# EAGLE design oresat0-plusz-end-card (EAGLE 9.6.2)

## Sheet 1 of 4: CONNECTORS
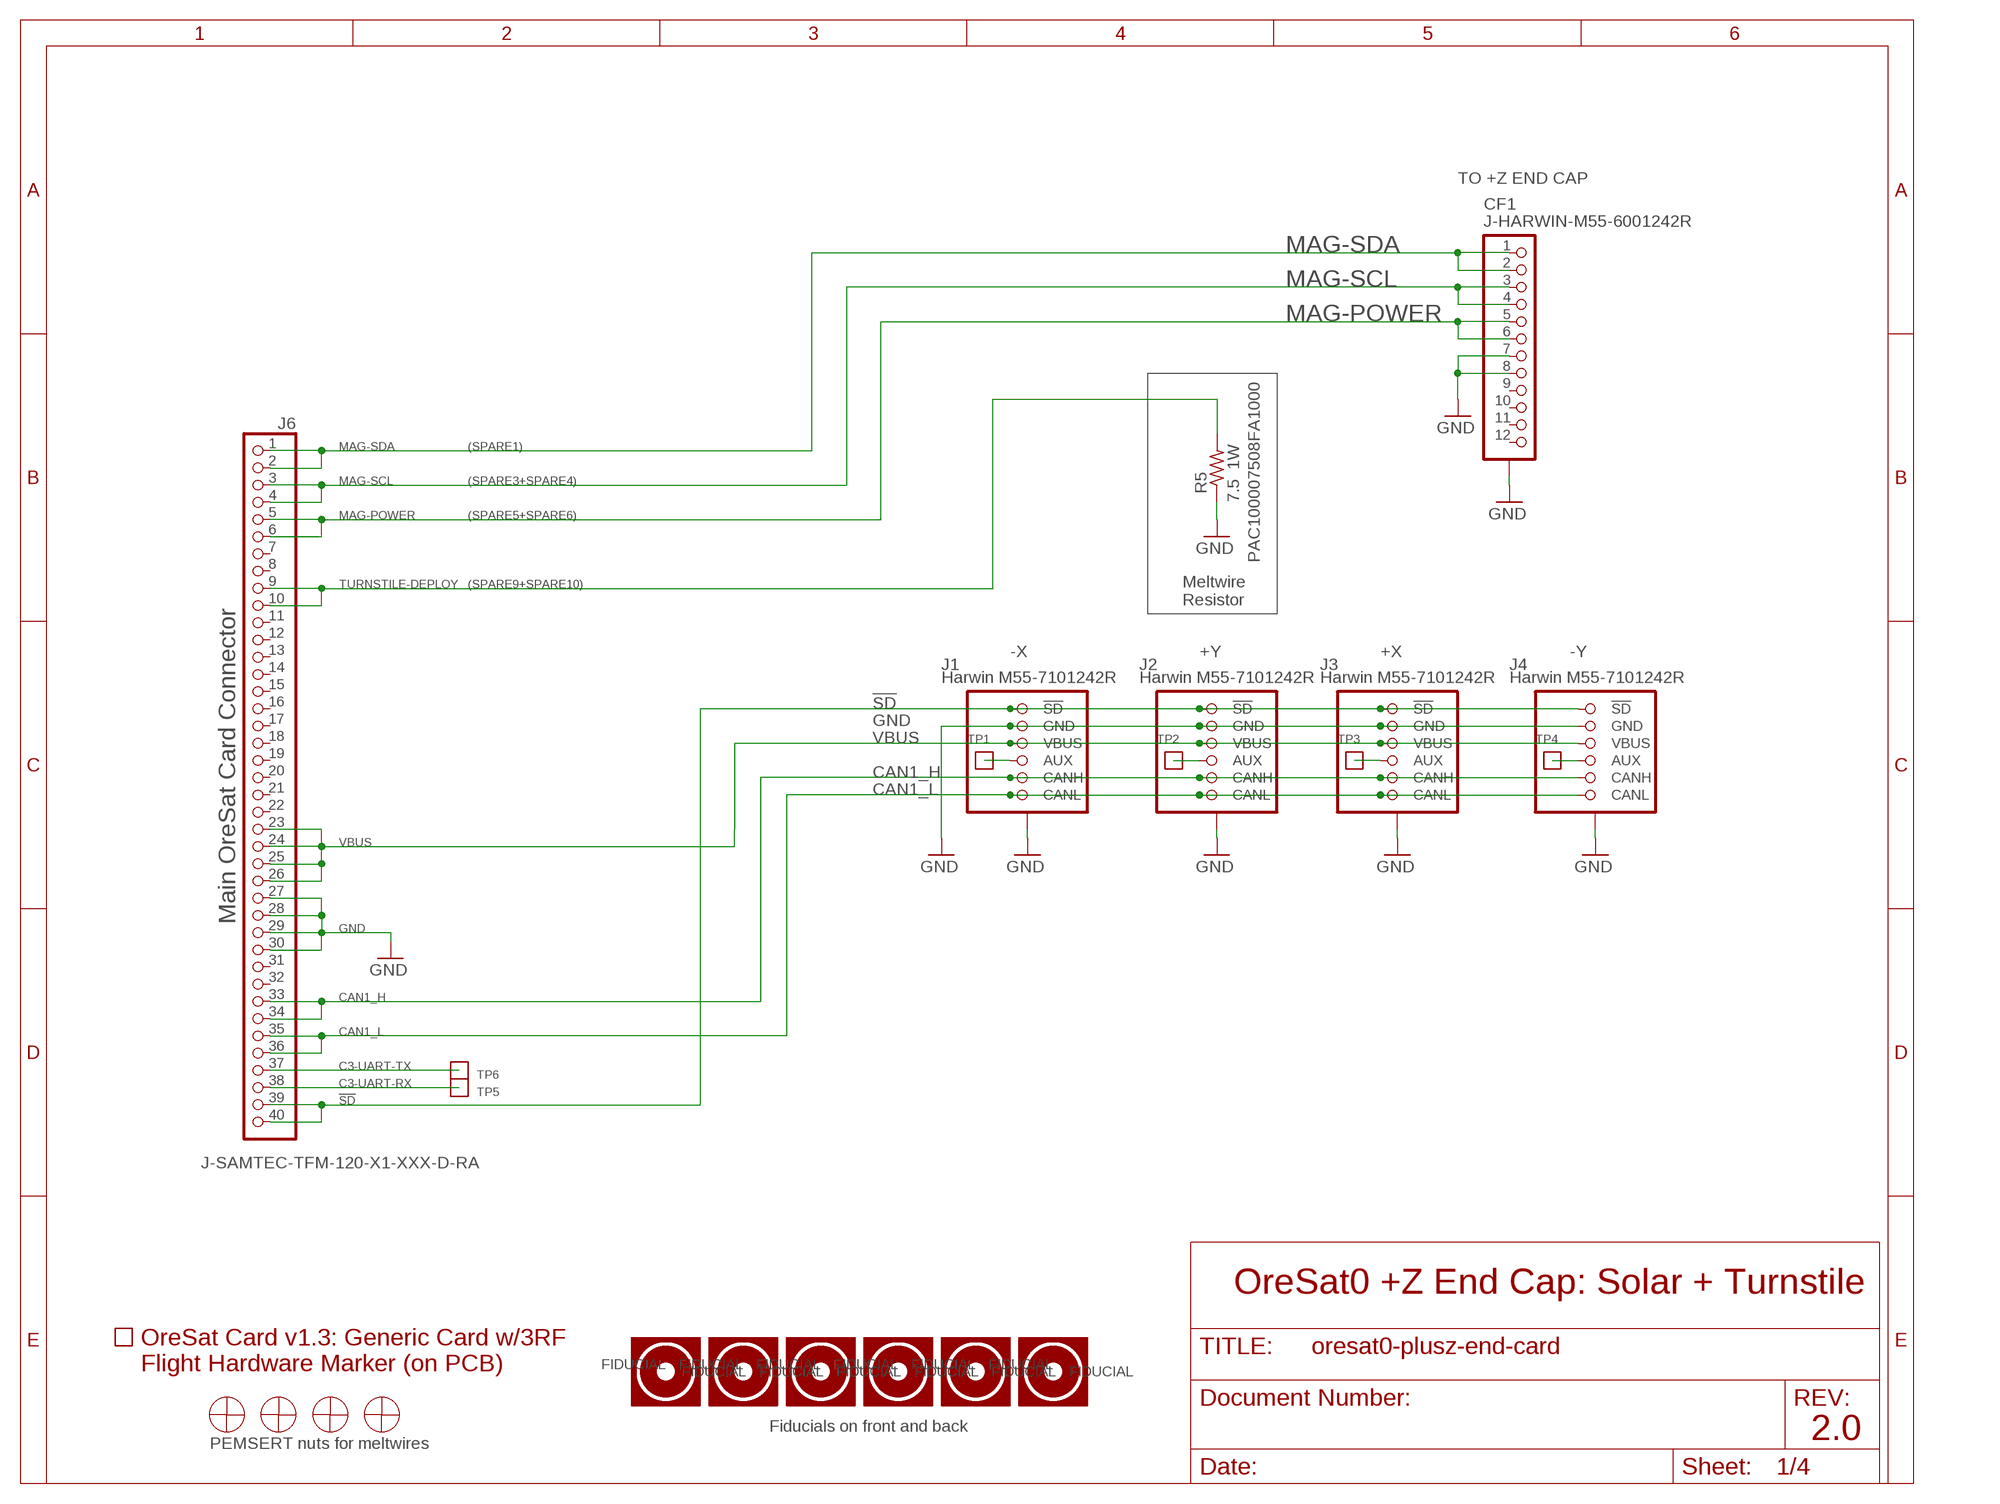
[diagram p0: schematic, sheet 1]

### Parts
CF1  J-HARWIN-M55-6001242R  J-HARWIN-M55-60X1242R  [HARWIN-M55-60X1242R]
FIDUCIAL1  FIDUCIAL-1.0X2.0  [FIDUCIAL-1.0X2.0]
FIDUCIAL2  FIDUCIAL-1.0X2.0  [FIDUCIAL-1.0X2.0]
FIDUCIAL3  FIDUCIAL-1.0X2.0  [FIDUCIAL-1.0X2.0]
FIDUCIAL4  FIDUCIAL-1.0X2.0  [FIDUCIAL-1.0X2.0]
FIDUCIAL5  FIDUCIAL-1.0X2.0  [FIDUCIAL-1.0X2.0]
FIDUCIAL6  FIDUCIAL-1.0X2.0  [FIDUCIAL-1.0X2.0]
HW1  MCMASTER-94100A150  [MCMASTER-94100A150]
HW2  MCMASTER-94100A150  [MCMASTER-94100A150]
HW3  MCMASTER-94100A150  [MCMASTER-94100A150]
HW4  MCMASTER-94100A150  [MCMASTER-94100A150]
J1  Harwin M55-7101242R  SOLAR-CARD-CONNECTOR  [M55-7101242R]
J2  Harwin M55-7101242R  SOLAR-CARD-CONNECTOR  [M55-7101242R]
J3  Harwin M55-7101242R  SOLAR-CARD-CONNECTOR  [M55-7101242R]
J4  Harwin M55-7101242R  SOLAR-CARD-CONNECTOR  [M55-7101242R]
J6  J-SAMTEC-TFM-120-X1-XXX-D-RA  [J-SAMTEC-TFM-120-X1-XXX-D-RA]
PCB1  ORESAT-CARD-V1.3-GENERIC-3RF  [ORESAT-CARD-V1.3-GENERIC-3RF]
R5  7.5 1W  PAC100-FOR-MELTWIRE  [PAC100-FOR-MELTWIRE]
TP1  TEST-POINT-LARGE-SQUARE  [1X01]
TP2  TEST-POINT-LARGE-SQUARE  [1X01]
TP3  TEST-POINT-LARGE-SQUARE  [1X01]
TP4  TEST-POINT-LARGE-SQUARE  [1X01]
TP5  TEST-POINT-LARGE-SQUARE  [1X01]
TP6  TEST-POINT-LARGE-SQUARE  [1X01]
U$1  FLIGHMARKERNEW  [FLIGHTMARKER_NEW_BOARDS]

### Nets
!SD [SHUTDOWN]: J1.1(!SD) J1.2(!SD) J2.1(!SD) J2.2(!SD) J3.1(!SD) J3.2(!SD) J4.1(!SD) J4.2(!SD) J6.39 J6.40
C3-UART-RX: J6.38 TP5.1
C3-UART-TX: J6.37 TP6.1
CAN1_H: J1.9(CANH) J1.10(CANH) J2.9(CANH) J2.10(CANH) J3.9(CANH) J3.10(CANH) J4.9(CANH) J4.10(CANH) J6.33 J6.34
CAN1_L: J1.11(CANL) J1.12(CANL) J2.11(CANL) J2.12(CANL) J3.11(CANL) J3.12(CANL) J4.11(CANL) J4.12(CANL) J6.35 J6.36
GND: CF1.7 CF1.8 CF1.P$1(SHIELDS) CF1.P$2(SHIELDS) CF1.P$3(SHIELDS) CF1.P$4(SHIELDS) J1.3(GND) J1.4(GND) J1.P$1(SHIELD) J1.P$2(SHIELD) J1.P$3(SHIELD) J1.P$4(SHIELD) J2.3(GND) J2.4(GND) J2.P$1(SHIELD) J2.P$2(SHIELD) J2.P$3(SHIELD) J2.P$4(SHIELD) J3.3(GND) J3.4(GND) J3.P$1(SHIELD) J3.P$2(SHIELD) J3.P$3(SHIELD) J3.P$4(SHIELD) J4.3(GND) J4.4(GND) J4.P$1(SHIELD) J4.P$2(SHIELD) J4.P$3(SHIELD) J4.P$4(SHIELD) J6.27 J6.28 J6.29 J6.30 R5.P$1 R5.P$2 ; also sheet 2,3,4
MAG-POWER: CF1.5 CF1.6 J6.5 J6.6
MAG-SCL: CF1.3 CF1.4 J6.3 J6.4
MAG-SDA: CF1.1 CF1.2 J6.1 J6.2
N$7: J1.7(AUX) J1.8(AUX) TP1.1
N$8: J2.7(AUX) J2.8(AUX) TP2.1
N$9: J3.7(AUX) J3.8(AUX) TP3.1
N$10: J4.7(AUX) J4.8(AUX) TP4.1
TURNSTILE-DEPLOY: J6.9 J6.10 R5.P$3 R5.P$4
VBUS: J1.5(VBUS) J1.6(VBUS) J2.5(VBUS) J2.6(VBUS) J3.5(VBUS) J3.6(VBUS) J4.5(VBUS) J4.6(VBUS) J6.23 J6.24 J6.25 J6.26
Unconnected: CF1.9 CF1.10 CF1.11 CF1.12 FIDUCIAL1.FIDUCIAL FIDUCIAL2.FIDUCIAL FIDUCIAL3.FIDUCIAL FIDUCIAL4.FIDUCIAL FIDUCIAL5.FIDUCIAL FIDUCIAL6.FIDUCIAL J6.7 J6.8 J6.11 J6.12 J6.13 J6.14 J6.15 J6.16 J6.17 J6.18 J6.19 J6.20 J6.21 J6.22 J6.31 J6.32

### Notes on the sheet
- TO +Z END CAP
- (SPARE1)
- (SPARE3+SPARE4)
- (SPARE5+SPARE6)
- PAC100007508FA1000
- (SPARE9+SPARE10)
- Meltwire
  Resistor
- -X | +Y | +X | -Y
- Main OreSat Card Connector
- OreSat0 +Z End Cap: Solar + Turnstile
- Fiducials on front and back
- 2.0
- PEMSERT nuts for meltwires

## Sheet 2 of 4: L BAND
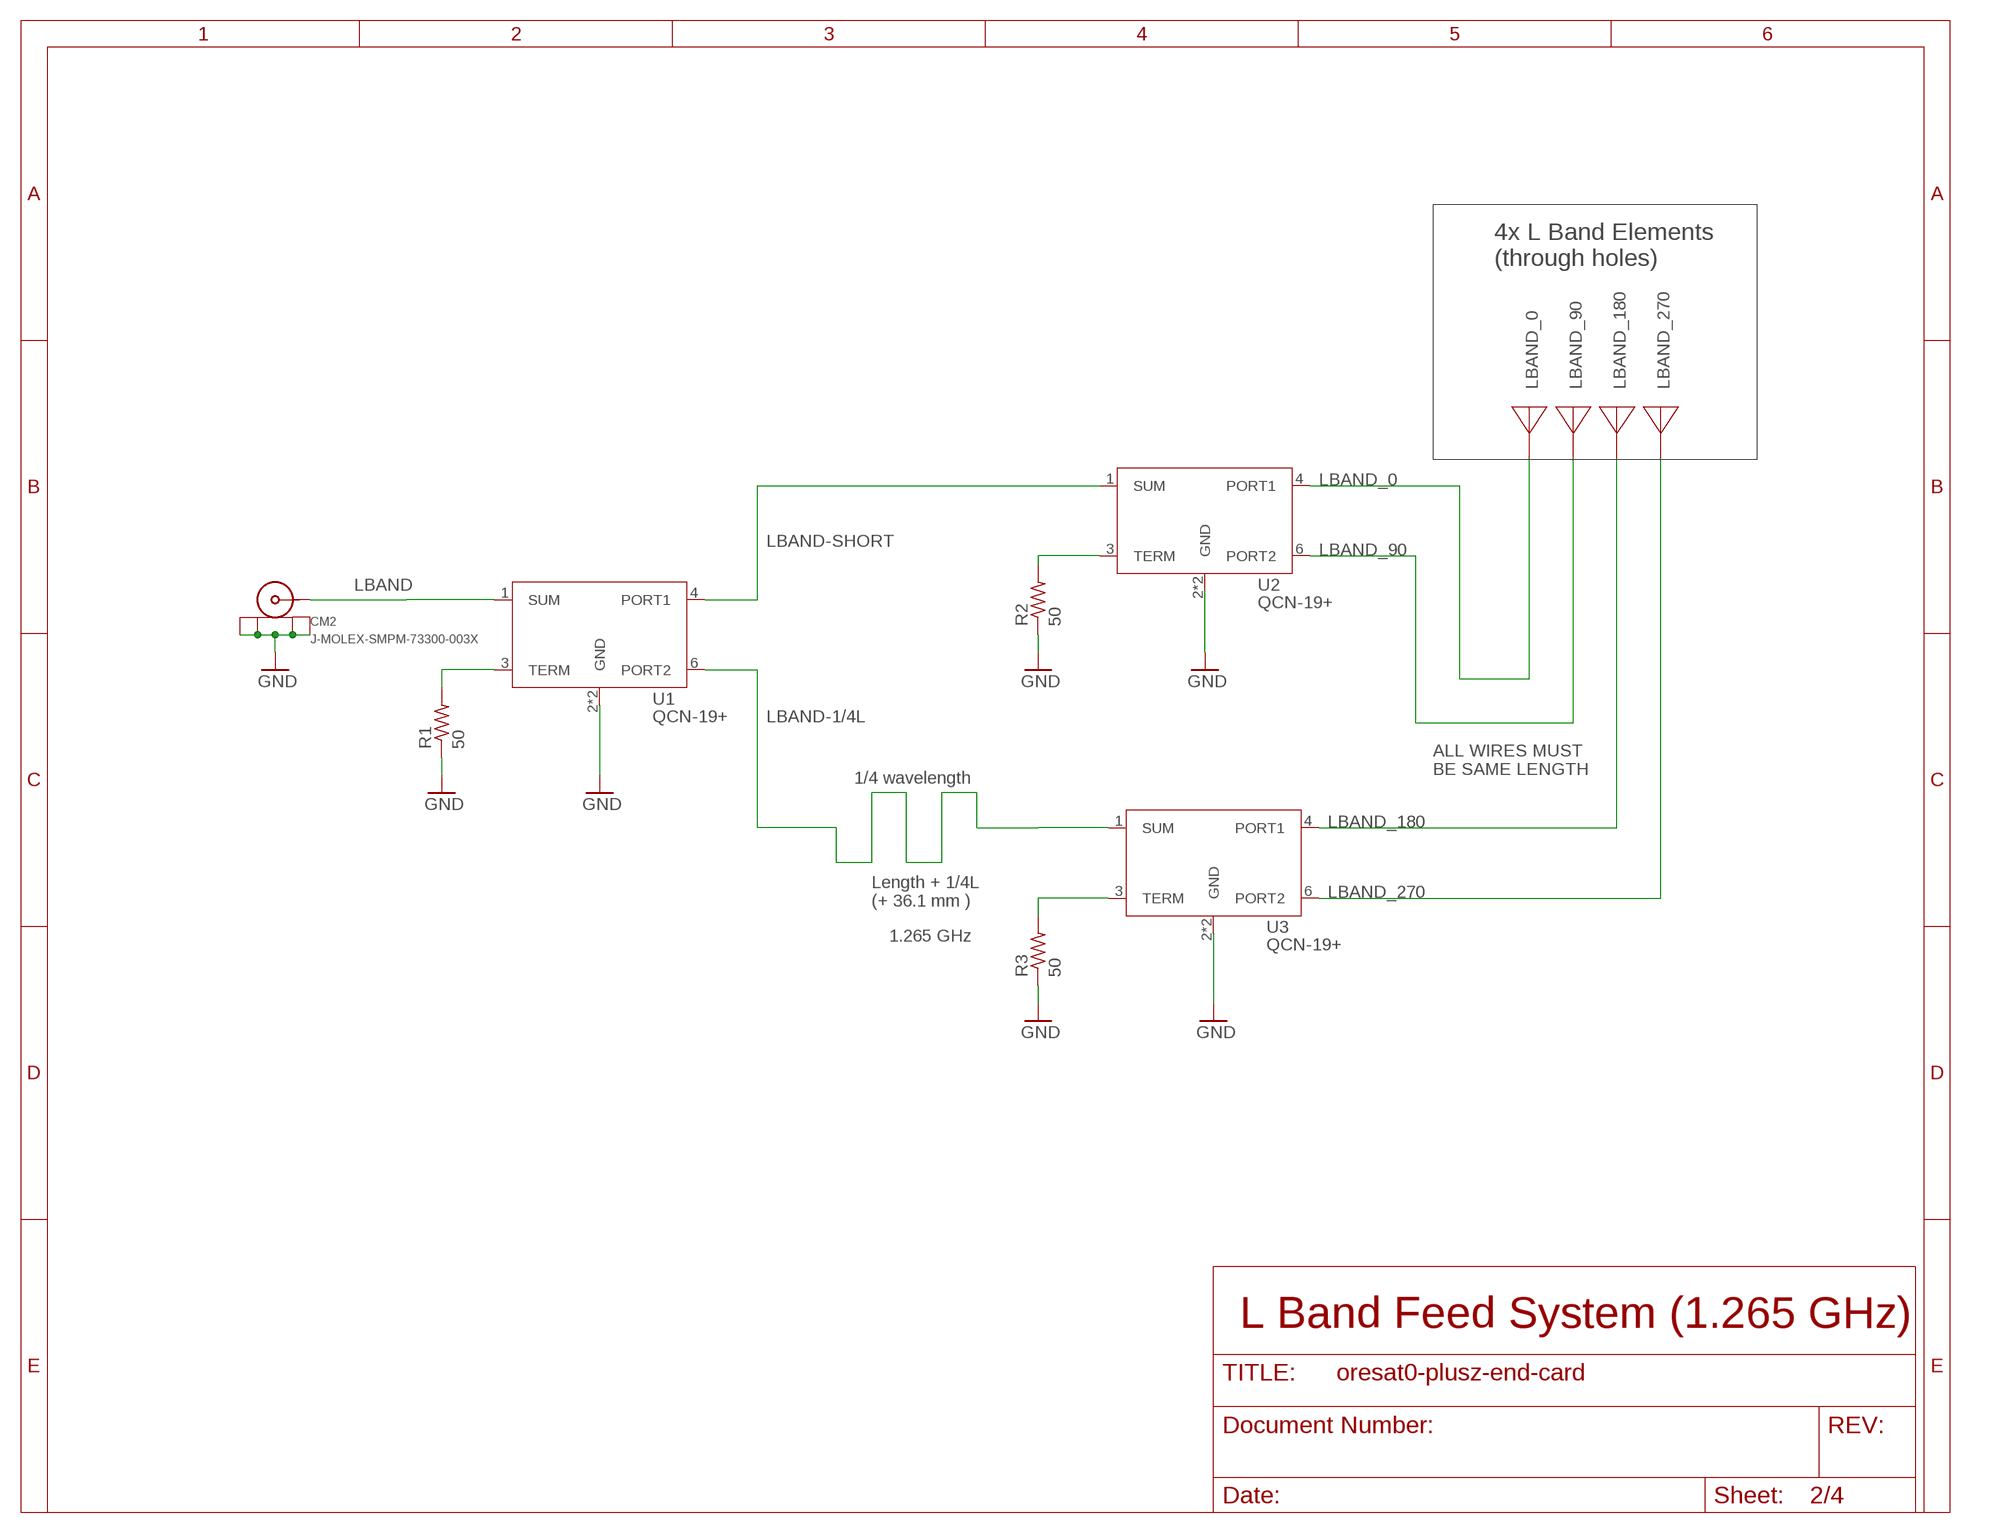
[diagram p1: schematic, sheet 2]

### Parts
CM2  J-MOLEX-SMPM-73300-003X  [J-MOLEX-SMPM-073300-003X]
R1  50  R-US_0603-C-NOSILK  [.0603-C-NOSILK]
R2  50  R-US_0603-C-NOSILK  [.0603-C-NOSILK]
R3  50  R-US_0603-C-NOSILK  [.0603-C-NOSILK]
U1  QCN-19+  QCN-XXX+  [QCN-XXX+]
U2  QCN-19+  QCN-XXX+  [QCN-XXX+]
U3  QCN-19+  QCN-XXX+  [QCN-XXX+]

### Nets
GND: CM2.P$1(SHIELD3) CM2.P$2(SHIELD2) CM2.P$3(SHIELD1) CM2.P$4(SHIELD) R1.1 R2.1 R3.1 U1.2(GND) U1.5(GND) U2.2(GND) U2.5(GND) U3.2(GND) U3.5(GND) ; also sheet 1,3,4
LBAND [RF]: CM2.RF(CENTER) U1.1(SUM)
LBAND-1/4L [RF]: U1.6(PORT2) U3.1(SUM)
LBAND-SHORT [RF]: U1.4(PORT1) U2.1(SUM)
LBAND_0 [RF]: U2.4(PORT1)
LBAND_90 [RF]: U2.6(PORT2)
LBAND_180 [RF]: U3.4(PORT1)
LBAND_270 [RF]: U3.6(PORT2)
N$3: R1.2 U1.3(TERM)
N$4: R2.2 U2.3(TERM)
N$6: R3.2 U3.3(TERM)

### Notes on the sheet
- 4x L Band Elements
  (through holes)
- ALL WIRES MUST
  BE SAME LENGTH
- 1/4 wavelength
- Length + 1/4L
  (+ 36.1 mm )
- 1.265 GHz
- L Band Feed System (1.265 GHz)

## Sheet 3 of 4: UHF
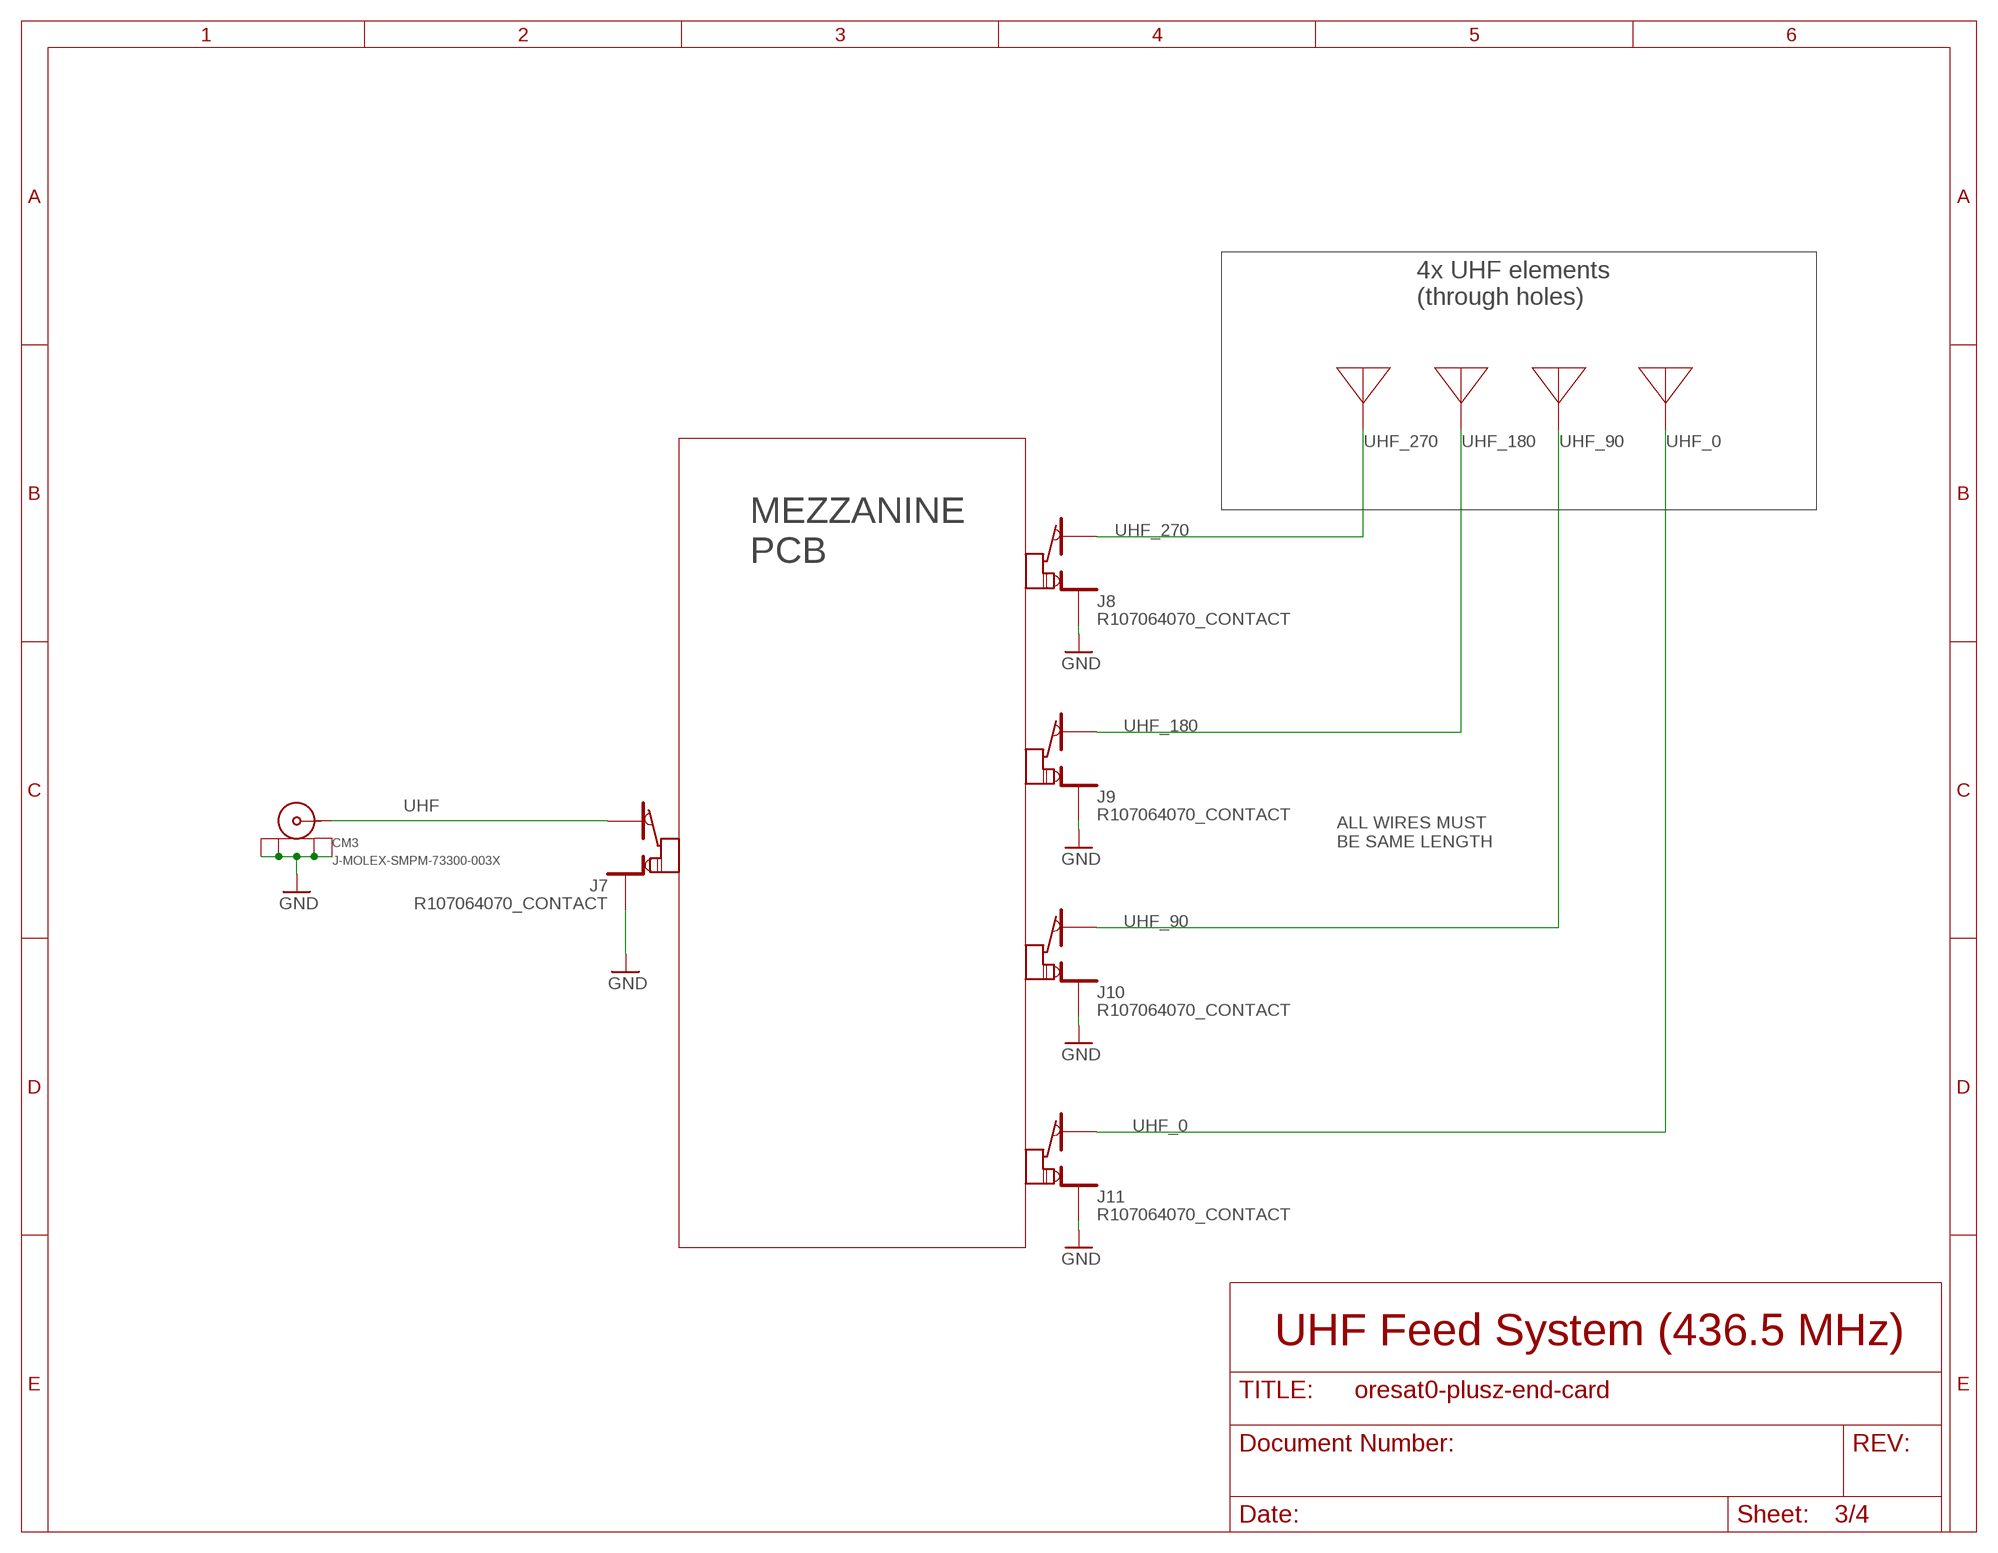
[diagram p2: schematic, sheet 3]

### Parts
CM3  J-MOLEX-SMPM-73300-003X  [J-MOLEX-SMPM-073300-003X]
J7  R107064070_CONTACT  [R107064070_CONTACT]
J8  R107064070_CONTACT  [R107064070_CONTACT]
J9  R107064070_CONTACT  [R107064070_CONTACT]
J10  R107064070_CONTACT  [R107064070_CONTACT]
J11  R107064070_CONTACT  [R107064070_CONTACT]

### Nets
GND: CM3.P$1(SHIELD3) CM3.P$2(SHIELD2) CM3.P$3(SHIELD1) CM3.P$4(SHIELD) J7.P$2 J7.P$3 J8.P$2 J8.P$3 J9.P$2 J9.P$3 J10.P$2 J10.P$3 J11.P$2 J11.P$3 ; also sheet 1,2,4
UHF [RF]: CM3.RF(CENTER) J7.P$1
UHF_0 [RF]: J11.P$1
UHF_90 [RF]: J10.P$1
UHF_180 [RF]: J9.P$1
UHF_270 [RF]: J8.P$1

### Notes on the sheet
- 4x UHF elements
  (through holes)
- MEZZANINE
  PCB
- ALL WIRES MUST 
  BE SAME LENGTH
- UHF Feed System (436.5 MHz)

## Sheet 4 of 4: L1 BAND
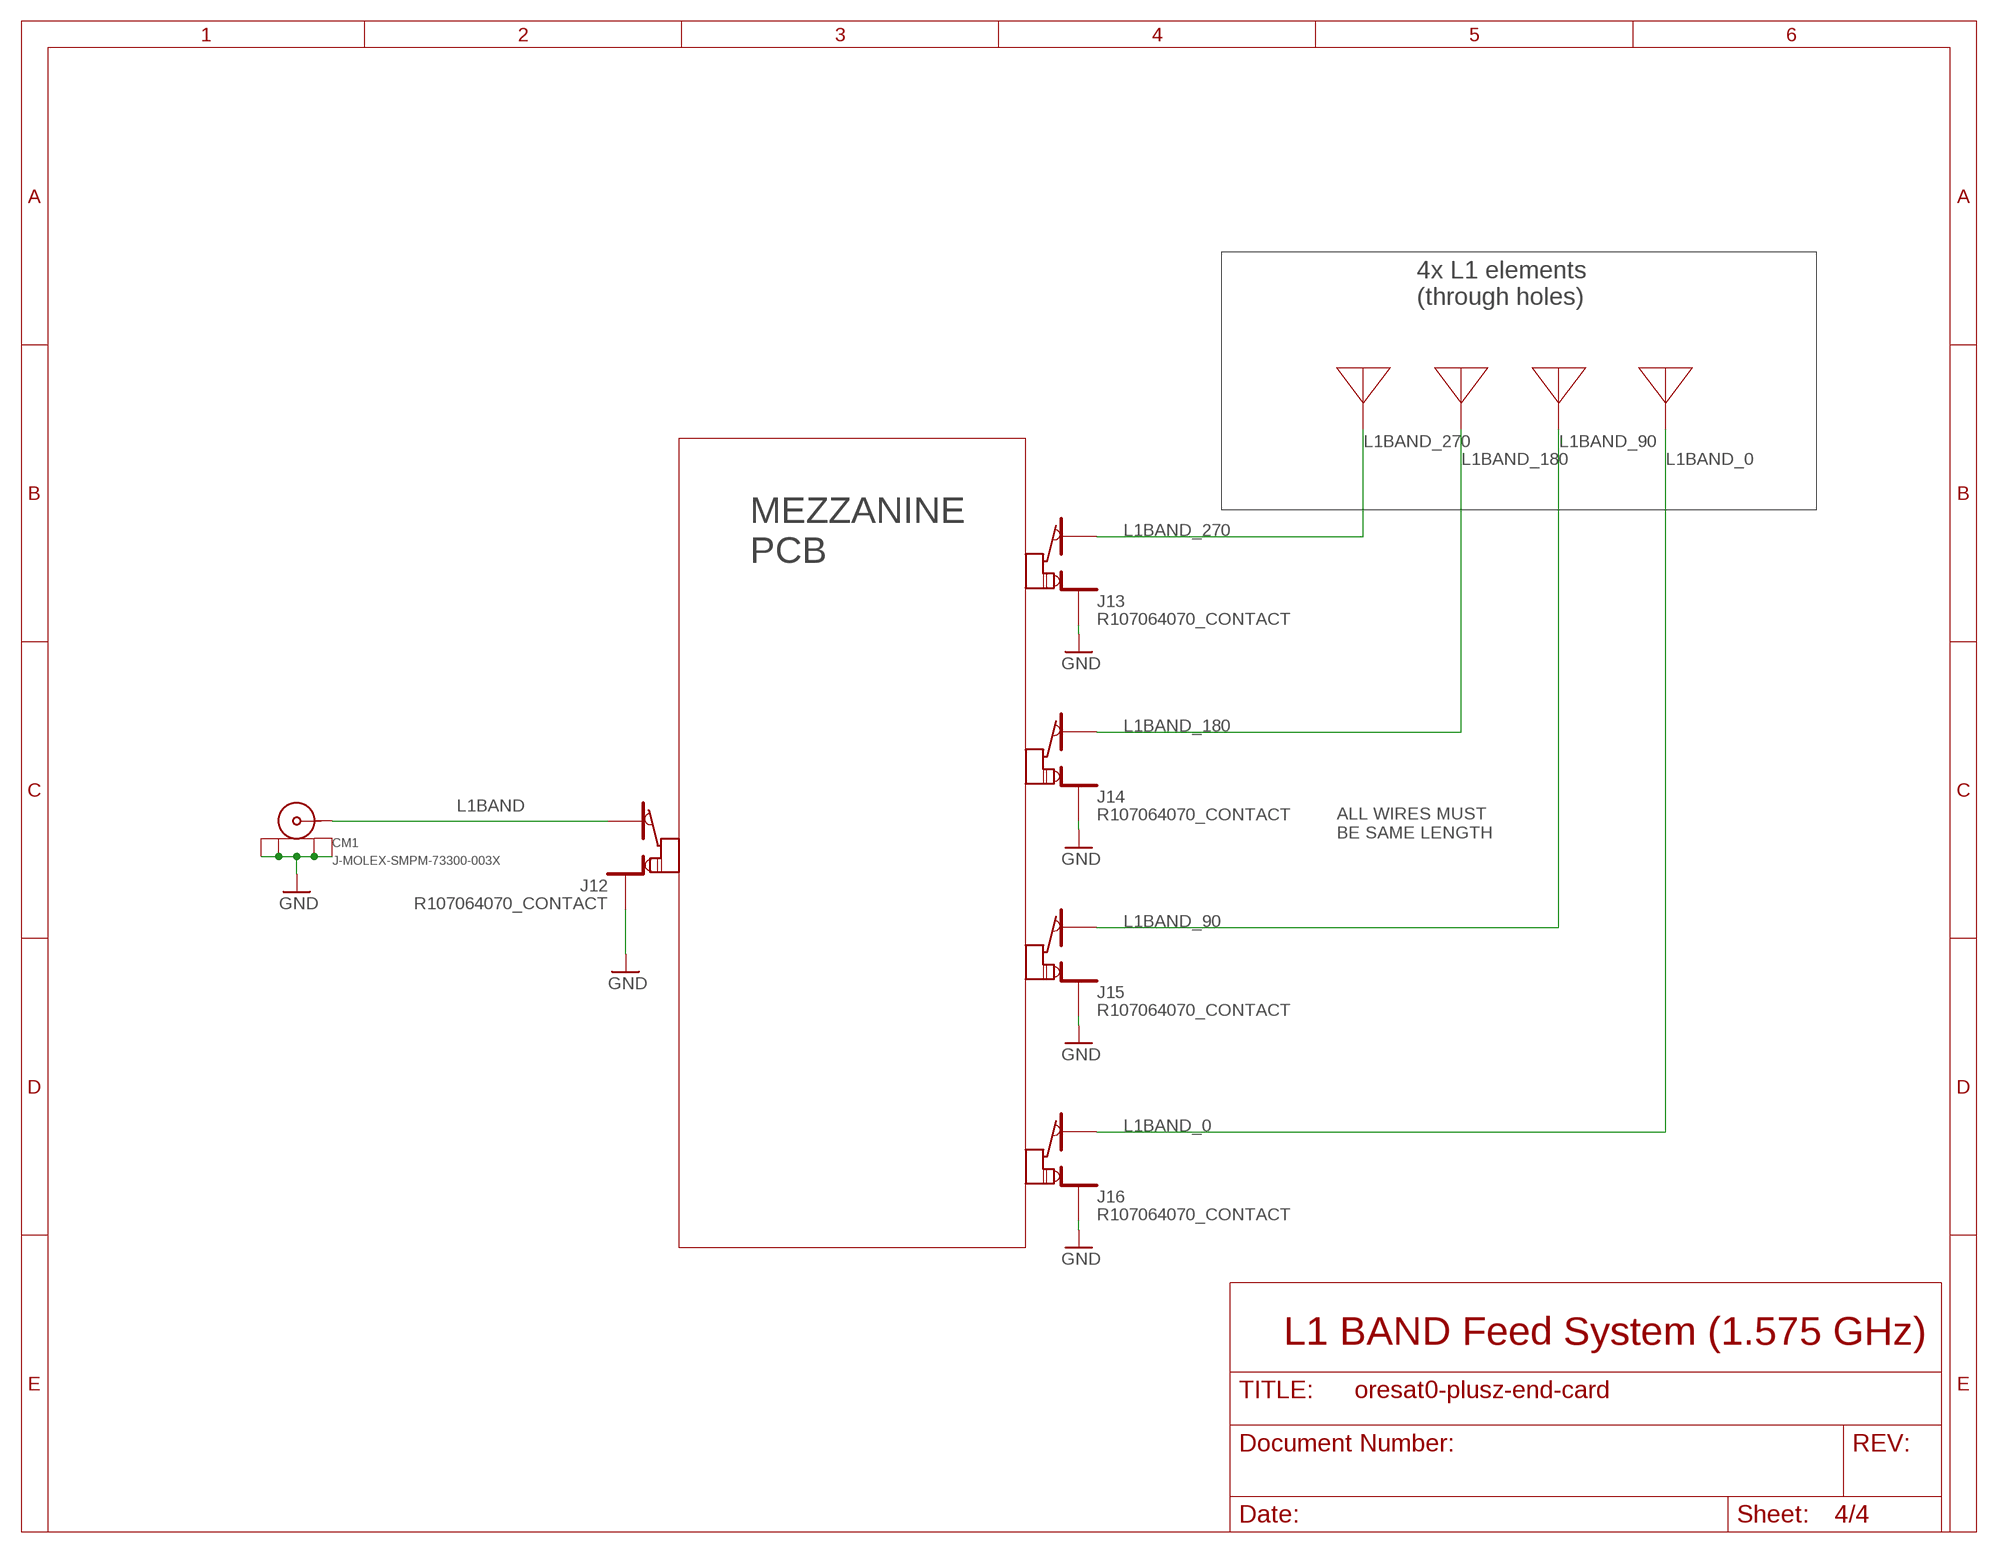
[diagram p3: schematic, sheet 4]

### Parts
CM1  J-MOLEX-SMPM-73300-003X  [J-MOLEX-SMPM-073300-003X]
J12  R107064070_CONTACT  [R107064070_CONTACT]
J13  R107064070_CONTACT  [R107064070_CONTACT]
J14  R107064070_CONTACT  [R107064070_CONTACT]
J15  R107064070_CONTACT  [R107064070_CONTACT]
J16  R107064070_CONTACT  [R107064070_CONTACT]

### Nets
GND: CM1.P$1(SHIELD3) CM1.P$2(SHIELD2) CM1.P$3(SHIELD1) CM1.P$4(SHIELD) J12.P$2 J12.P$3 J13.P$2 J13.P$3 J14.P$2 J14.P$3 J15.P$2 J15.P$3 J16.P$2 J16.P$3 ; also sheet 1,2,3
L1BAND [RF]: CM1.RF(CENTER) J12.P$1
L1BAND_0 [RF]: J16.P$1
L1BAND_90 [RF]: J15.P$1
L1BAND_180 [RF]: J14.P$1
L1BAND_270 [RF]: J13.P$1

### Notes on the sheet
- 4x L1 elements
  (through holes)
- MEZZANINE
  PCB
- ALL WIRES MUST
  BE SAME LENGTH
- L1 BAND Feed System (1.575 GHz)

## Library data of the parts
CF1 = J-Harwin-M55-60X1242R-12pin-1.27mm-F-vertical:J-HARWIN-M55-60X1242R; MFG: Harwin; MFG_PN: M55-60X1242R; P-NP: P
CM1-CM3 = J-Molex-73300-003X-SMPM-M-edge-mount-NO-DIM:J-MOLEX-SMPM-73300-003X: Edge mounted SMPM 50ohm Connector 0733000020; DESCRIPTION: SMPM Edge Mounted 50 ohm RF connector; DIST: Digi-Key; DIST_PN: WM10772-ND; GENERIC: N; MFG: MOLEX; MFG_PN: 0733000020; P-NP: P
FIDUCIAL1-FIDUCIAL6 = monitor-v2-debug:FIDUCIAL: Fiducials for optical coordinate reference
HW1-HW4 = HW-mcmaster-94100A150-M2-threaded-insert:MCMASTER-94100A150
J1-J4 = J-Harwin-M55-7101242-Solar-card-connector:SOLAR-CARD-CONNECTOR: OreSat End Card Solar Connector This 12pin 1.27 mm male SMT connector (Harwin M55-7101242R) is used on the end cards to attach to the solar boards. Note: alignment pin hole diameters are 0.05 mm smaller than recommended in order to tighten up connector location; this requires hand placement of this package.; DESCRIPTION: SMT 12 pos Conn Header 1.27mm pitch; DIST: Digi-Key; DIST_PN: 952-3891-ND; GENERIC: N; MFG: Harwin Inc.; MFG_PN: M55-7101242R; P-NP: P
J6 = J-Samtec-TFM-120-X1-XXX-D-RA:J-SAMTEC-TFM-120-X1-XXX-D-RA; DIS: Digi-Key; DPN: SAM10145-ND; MFR: Samtec; MPN: TFM-120-01-L-D-RA
J7-J16 = J-Radiall-R107064070-RF:R107064070_CONTACT: Contact pad for surface to surface RF connector This is not a physical part, it's just a landing pad Datasheet for physical part: Datasheet <https://www.mouser.com/datasheet/2/516/radiall_radls10120-1-1746158.pdf>; DESCRIPTION: Landing pad for RF connector; P-NP: NP
PCB1 = oresat-cards:ORESAT-CARD-V1.3-GENERIC-3RF
R1-R3 = oresat-rcl:R-US_: RESISTOR, American symbol
R5 = R-Vishay-PAC1000-1W-resistor:PAC100-FOR-MELTWIRE
TP1-TP6 = oresat-misc:TEST-POINT-LARGE-SQUARE
U1-U3 = U-MiniCirc-QCN-XXX+-quad:QCN-XXX+: RF Power Splitter/Combiner, Quadrature Hybrid QCN-19+ 1100 - 1925 MHz Datasheet: Datasheet <https://www.minicircuits.com/pdfs/QCN-19+.pdf>; DESCRIPTION: Signal Conditioning LTCC 90 Hybrid, 1100-1925 MHz, 50 ohms; DIST: Mouser; DIST_PN: 139-QCN-19; GENERIC: N; MFG: Mini-Circuits; MFG_PN: QCN-19+; P-NP: P
U$1 = oresat-flight-marker:FLIGHMARKER

## Net classes
1 RF: clearance 0.85 mm
2 SHUTDOWN: clearance 0.3 mm

## Board
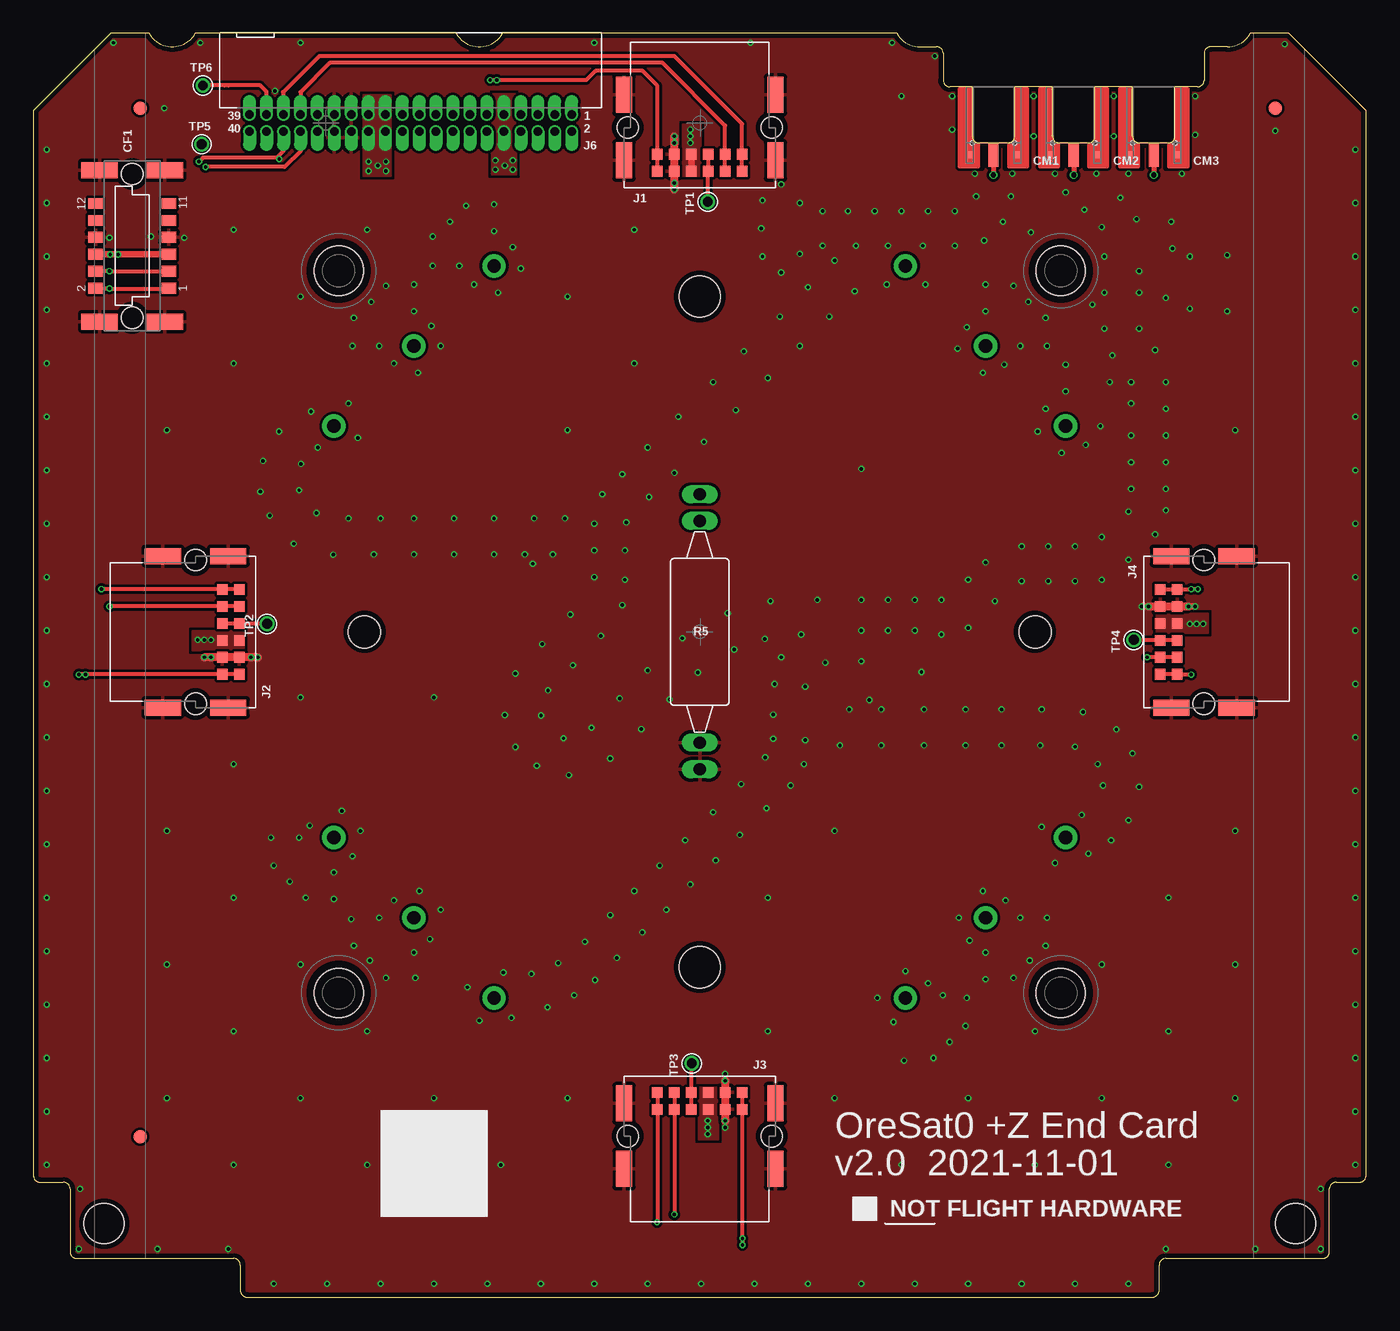
[diagram p4: board, top side]
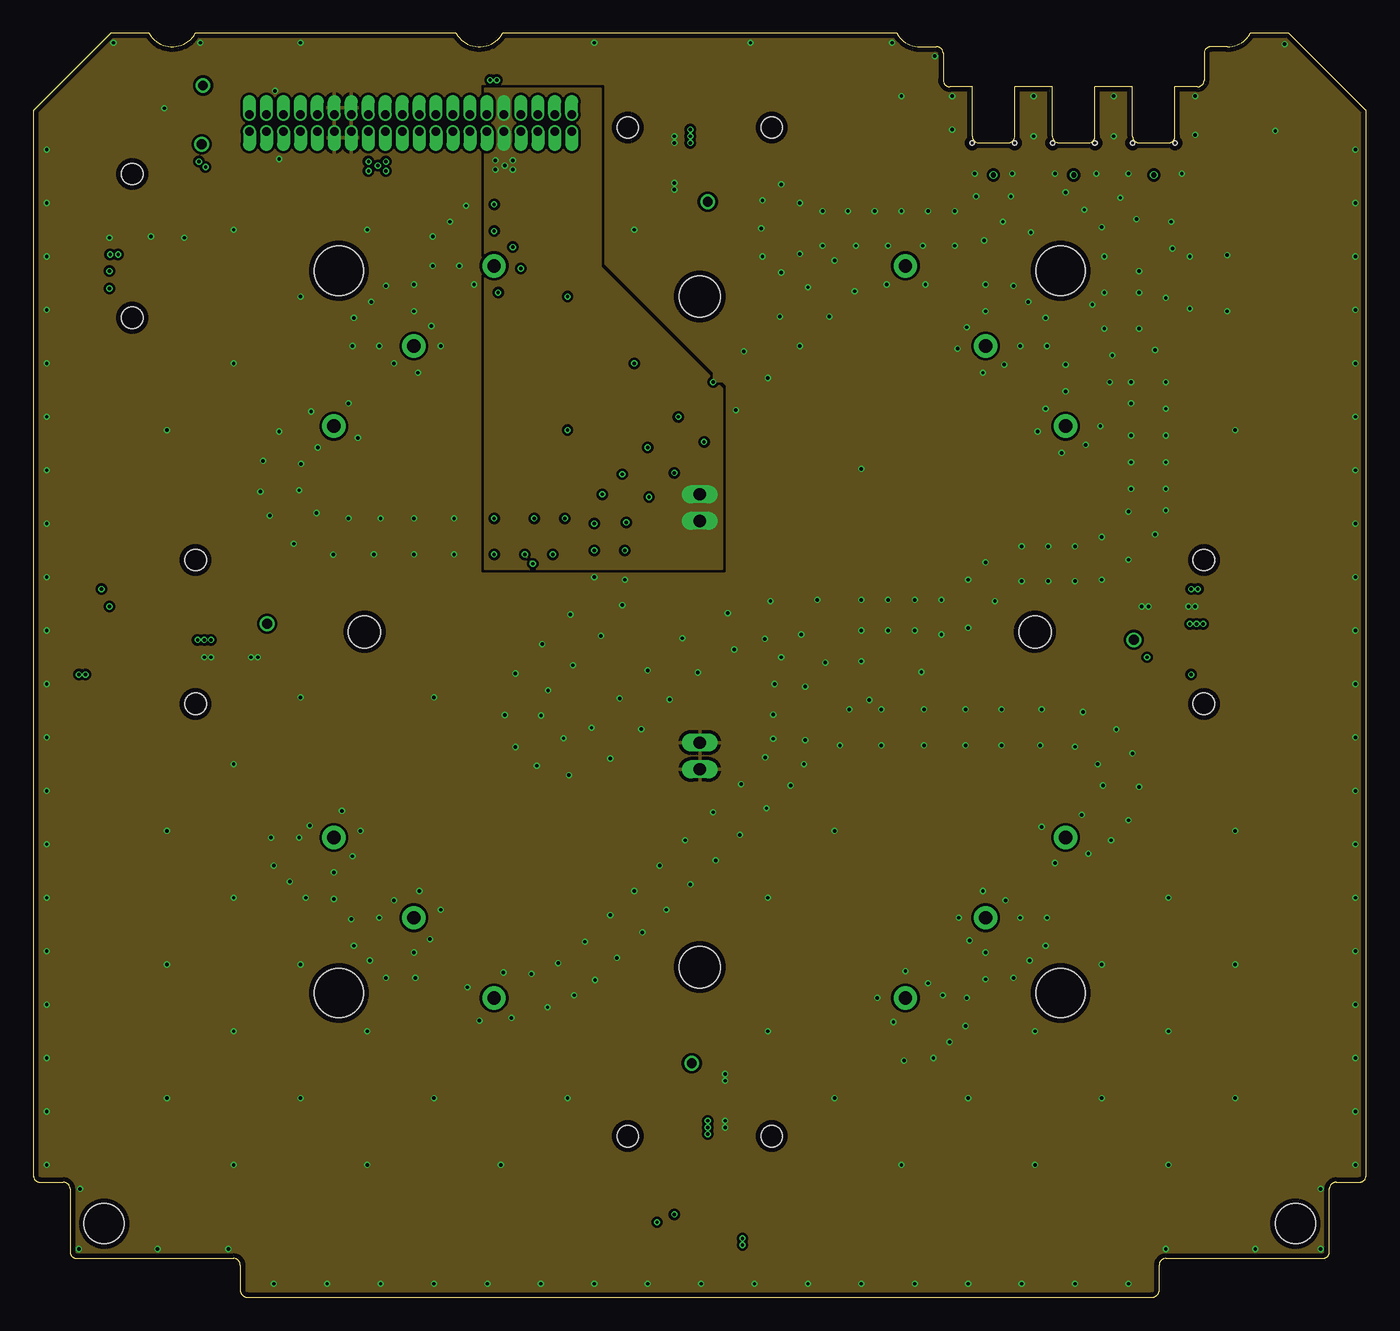
[diagram p5: board, inner layer Route2]
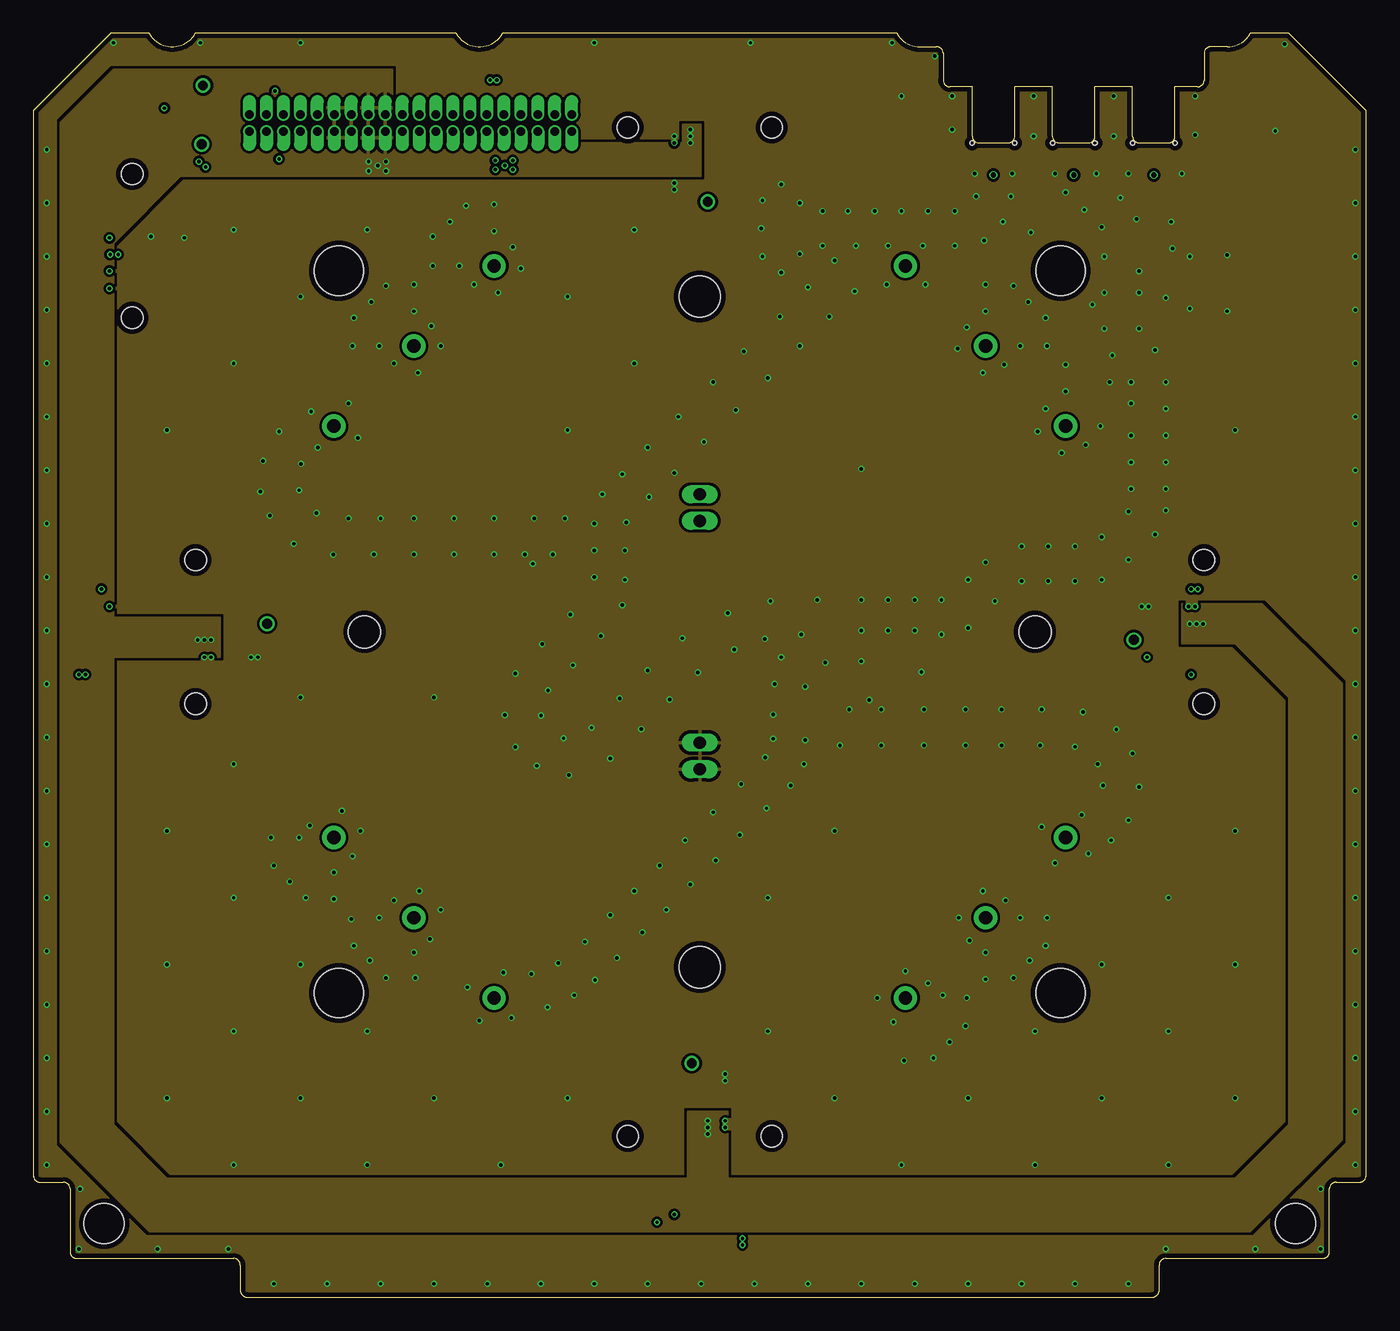
[diagram p6: board, inner layer Route15]
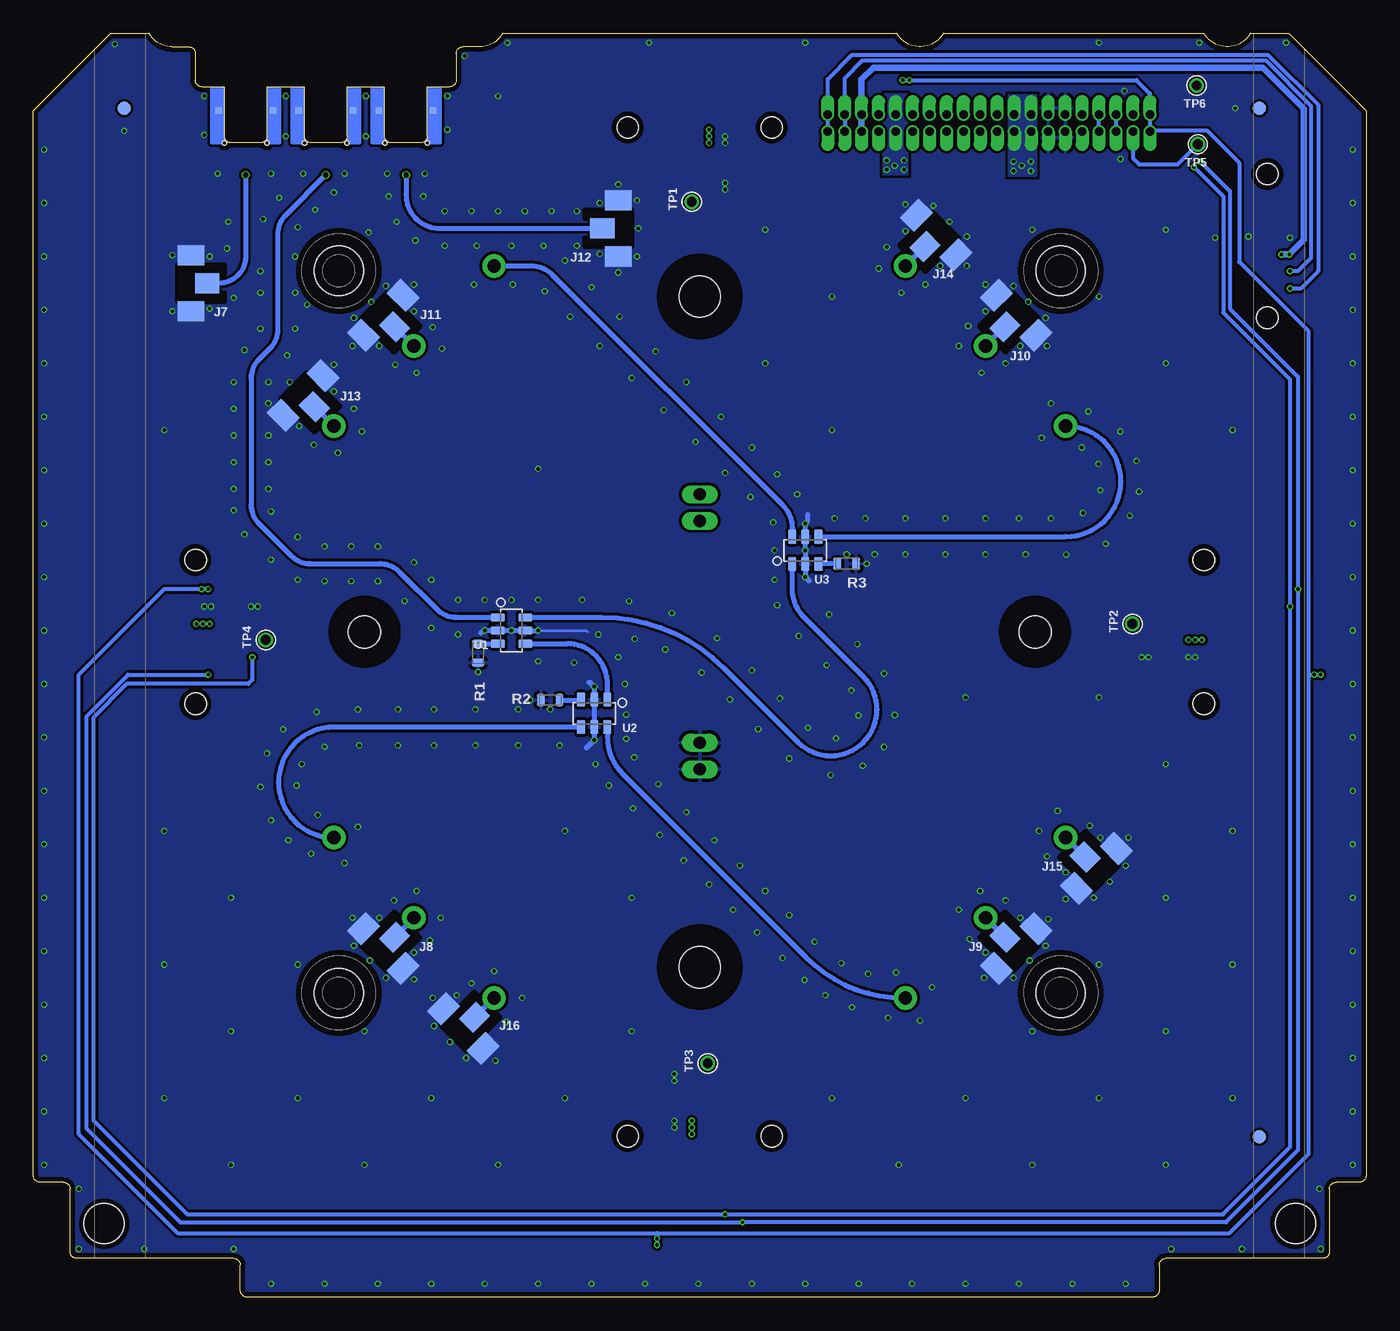
[diagram p7: board, bottom side, seen from below]

Size 99.8 x 94.6 mm. Coordinates in mm from the lower left corner, seen from the top.
Copper layers (1*2*15*16): Top 0.035559375mm / dielectric 0.17018125mm / Route2 0.01778125mm / dielectric 47mil / Route15 0.01778125mm / dielectric 0.17018125mm / Bottom 0.035559375mm
Design rules "oshpark-4layer *": minimum track width 5mil, minimum drill 10mil, track to track 5mil, track to pad 5mil, pad to pad 5mil, via to via 5mil, smd to smd 5mil, copper to edge 15mil, drill to drill 6mil, minimum pad ring 4mil, minimum via ring 4mil, stop-mask expansion 2.5mil, vias tented up to drill 10mil, thermal gap 10mil
Holes 3.1 mm at 49.9,74.9 49.9,24.7
Holes 2.4 mm at 24.8,49.8 75,49.8
bRestrict: area 46.9,71.9 to 52.9,77.9; area 46.9,21.7 to 52.9,27.7; area 22.3,47.3 to 27.3,52.3; area 72.5,47.3 to 77.5,52.3

### Footprints (pad centres in the part's own frame; a part is rotated, then mirrored left to right if it is on the bottom)
HARWIN-M55-60X1242R = smd 0.8 x 1.1: 1 -3.175,-2.75; 2 -3.175,2.75; 3 -1.905,-2.75; 4 -1.905,2.75; 5 -0.635,-2.75; 6 -0.635,2.75; 7 0.635,-2.75; 8 0.635,2.75; 9 1.905,-2.75; 10 1.905,2.75; 11 3.175,-2.75; 12 3.175,2.75 | smd 1.2 x 2.7: P$1 -5.67,-2.45; P$2 -5.67,2.45; P$3 5.67,2.45; P$4 5.67,-2.45 | hole 1.6: -5.385,0; 5.385,0
J-MOLEX-SMPM-073300-003X = smd 0.508 x 0.508: P$1 -1.778,-5.08; P$2 1.778,-5.08 | smd 0.508 x 0.508 bottom: P$3 -2.032,-1.778; P$4 2.032,-1.778 | smd 0.762 x 1.778: RF 0,-5.08
FIDUCIAL-1.0X2.0 = smd 1 x 1: FIDUCIAL 0,0
MCMASTER-94100A150 = hole 3.7: 0,0
M55-7101242R = smd 0.8 x 0.8: 1 3.175,2; 2 3.175,3.27; 3 1.905,2; 4 1.905,3.27; 5 0.635,2; 6 0.635,3.27; 7 -0.635,2; 8 -0.635,3.27; 9 -1.905,2; 10 -1.905,3.27; 11 -3.175,2; 12 -3.175,3.27 | smd 1.2 x 2.7: P$1 5.67,2.45; P$2 5.67,-2.45; P$3 -5.67,2.45; P$4 -5.67,-2.45 | hole 1.6: 5.385,0; -5.385,0
J-SAMTEC-TFM-120-X1-XXX-D-RA = drill 0.635 pad 0.965 offset: 1 12.065,0.635; 2 12.065,-0.635; 3 10.795,0.635; 4 10.795,-0.635; 5 9.525,0.635; 6 9.525,-0.635; 7 8.255,0.635; 8 8.255,-0.635; 9 6.985,0.635; 10 6.985,-0.635; 11 5.715,0.635; 12 5.715,-0.635; 13 4.445,0.635; 14 4.445,-0.635; 15 3.175,0.635; 16 3.175,-0.635; 17 1.905,0.635; 18 1.905,-0.635; 19 0.635,0.635; 20 0.635,-0.635; 21 -0.635,0.635; 22 -0.635,-0.635; 23 -1.905,0.635; 24 -1.905,-0.635; 25 -3.175,0.635; 26 -3.175,-0.635; 27 -4.445,0.635; 28 -4.445,-0.635; 29 -5.715,0.635; 30 -5.715,-0.635; 31 -6.985,0.635; 32 -6.985,-0.635; 33 -8.255,0.635; 34 -8.255,-0.635; 35 -9.525,0.635; 36 -9.525,-0.635; 37 -10.795,0.635; 38 -10.795,-0.635; 39 -12.065,0.635; 40 -12.065,-0.635
R107064070_CONTACT = smd 1.5 x 1.8: P$1 0,-1.2 | smd 1.5 x 2: P$2 -2.1,0; P$3 2.1,0
ORESAT-CARD-V1.3-GENERIC-3RF = hole 0.32: 70.31,86.4; 73.49,86.4; 76.31,86.4; 79.49,86.4; 85.49,86.4; 82.31,86.4 | hole 3: 94.5,5.5; 5.3,5.5
.0603-C-NOSILK = smd 0.6 x 0.9: 1 -0.7,0; 2 0.7,0
PAC100-FOR-MELTWIRE = drill 0.9 long: P$1 0,8.3; P$2 0,10.3; P$3 0,-8.3; P$4 0,-10.3
1X01 = drill 0.737 pad 1.1: 1 0,0
QCN-XXX+ = smd 0.61 x 1.07: 1 -0.99,-1.025; 2 0,-1.025; 3 0.99,-1.025; 4 0.99,1.025; 5 0,1.025; 6 -0.99,1.025

### Placement (x,y rotation side)
CF1  7.4,78.7 90 top
CM1  71.9,90.6 0 top
CM2  77.9,90.6 0 top
CM3  83.9,90.6 0 top
FIDUCIAL1  8,12 0 top
FIDUCIAL2  8,89 0 top
FIDUCIAL3  93,89 0 top
FIDUCIAL4  8,89 0 bottom
FIDUCIAL5  93,89 0 bottom
FIDUCIAL6  8,12 0 bottom
HW1  76.93,76.83 0 top
HW2  76.93,22.77 0 top
HW3  22.87,76.83 0 top
HW4  22.87,22.77 0 top
J1  49.9,87.55 180 top
J2  12.15,49.8 270 top
J3  49.9,12.05 0 top
J4  87.65,49.8 90 top
J6  28.25,87.9 0 top
J7  88,75.9 90 bottom
J8  73.6,26.1 135 bottom
J9  26.2,26.1 225 bottom
J10  26.2,73.5 315 bottom
J11  73.6,73.5 45 bottom
J12  56,80 270 bottom
J13  79.6,67.5 45 bottom
J14  32.2,79.5 315 bottom
J15  20.2,32.1 225 bottom
J16  67.6,20.1 135 bottom
PCB1  0,0 0 top
R1  66.5,48.2 90 bottom
R2  61.1,44.7 0 bottom
R3  38.9,54.9 180 bottom
R5  49.9,49.8 180 top
TP1  50.5,82 90 top
TP2  17.5,50.4 90 top
TP3  49.3,17.5 90 top
TP4  82.4,49.2 90 top
TP5  12.6,86.3 0 top
TP6  12.7,90.7 0 top
U1  64,49.9 270 bottom
U2  57.8,43.7 180 bottom
U3  42,55.9 0 bottom
U$1  61.6,6 0 top

### Tracks (layer width: path | path; a pad name or v marks a point on that pad's centre or on a via)
!SD  (via drill 0.25)
  Top 0.3: J1.2 J1.1 46.73,90.67 45.6,91.8 42.1,91.8 41.4,91.1 v34.2,91.1 | J2.2 J2.1 3.42,46.62 v3.4,46.6 | J3.2 J3.1 53.08,4.42 v53.1,4.4 v53.1,3.9 | J4.2 J4.1 86.7,52.98 v86.7,53 v87.2,53
  Bottom 0.3: 53.1,4.8 89,4.8 96.4,12.2 96.4,46.6 90,53 v86.7,53 | 53.1,4.8 10.23,4.8 4.3,10.73 4.3,46.6 | 53.1,4.8 v53.1,4.4 v53.1,3.9 | 4.3,46.6 4.3,72.3 9.5,77.5 9.5,84.9 11.9,87.3 16.15,87.3 J6.40 J6.39 16.18,90.08 17.2,91.1 v34.2,91.1 v34.7,91.1 | 4.3,46.6 v3.9,46.6 v3.4,46.6
C3-UART-RX
  Bottom 0.3: J6.38 17.45,85.25 17,84.8 14.1,84.8 TP5.1
C3-UART-TX
  Top 0.3: J6.37 17.45,90.25 17,90.7 14.6,90.7 | 14.6,90.7 14.3,90.7 | 14.6,90.7 TP6.1
CAN1_H  (via drill 0.25)
  Top 0.3: J1.10 J1.9 51.8,87.69 47.1,92.4 22.2,92.4 20,90.19 J6.33 | J2.10 J2.9 v5.71,51.7 v5.7,51.7 | J3.10 J3.9 v47.99,6.2 v48,6.2 | J4.9 J4.10 v83.4,47.9 | J6.34 20,85.8 18.8,84.6 v12.9,84.6
  Bottom 0.3: J6.34 J6.33 | v83.4,47.9 83.4,46.2 83.7,45.9 92.8,45.9 95.27,43.42 95.27,13.2 88.27,6.2 v48,6.2 10.73,6.2 5.7,11.23 v5.7,51.7 5.7,68.7 10.7,73.7 10.7,82.4 v12.9,84.6
CAN1_L  (via drill 0.25)
  Top 0.3: J1.12 J1.11 53.08,87.83 48,92.9 21.4,92.9 18.7,90.2 18.7,88.56 J6.35 | J2.12 J2.11 5.12,52.98 v5.1,53 | J3.12 J3.11 46.73,5.61 v46.7,5.61 | v86.7,46.6 85.65,46.6 J4.11 J4.12 | J6.36 18.73,85.83 18.2,85.3 12.7,85.3 v12.4,85
  Bottom 0.3: J6.35 J6.36 | v86.7,46.6 92.7,46.6 95.8,43.5 95.8,12.6 88.8,5.6 v46.7,5.6 | v46.7,5.6 10.5,5.6 5.1,11 v5.1,53 5.1,68.9 10.2,74 10.2,82.8 v12.4,85 | v46.7,5.61 v46.7,5.6
GND  (via drill 0.25)
  Top 0.5: 83.19,51.7 83.1,51.8 | 86.8,51.7
  Top 0.6: v83.5,51.7 J4.4 J4.3 v86.5,51.7 | v51.8,16.2 J3.4 J3.3 v51.8,13.21 v51.8,13.2 | v16.8,47.9 v16.3,47.9 J2.4 J2.3 v13.3,47.9 v12.8,47.9 | v48,82.9 v48,83.4 J1.4 J1.3 v47.99,86.39 v48,86.4 v48,86.9
  Bottom 0.2: v62,49.9 58.4,49.9 58.3,49.8
  Bottom 0.38: v62,49.9 U1.5 v64,49.9 U1.2 v66,49.9 66.1,49.9 66.3,49.7 | 41.8,58.6 41.8,58.1 v42,57.9 U3.5 v42,55.9 U3.2 v42,53.9 41.7,53.6 | 58.4,41.1 v57.8,41.7 U2.5 U2.2 v57.8,45.7 58.1,46 58.2,46
  other vias: 1,9.9 1,13.9 1,17.9 1,21.9 1,25.9 1,29.9 1,33.9 1,37.9 1,41.9 1,45.9 1,49.9 1,53.9 1,57.9 1,61.9 1,65.9 1,69.9 1,73.9 1,77.9 1,81.9 1,85.9 99,9.9 99,13.9 99,17.9 99,21.9 99,25.9 99,29.9 99,33.9 99,37.9 99,41.9 99,45.9 99,49.9 99,53.9 99,57.9 99,61.9 99,65.9 99,69.9 99,73.9 99,77.9 99,81.9 99,85.9 18,1 22,1 26,1 30,1 34,1 38,1 42,1 46,1 50,1 54,1 58,1 62,1 66,1 70,1 74,1 78,1 82,1 9.8,89 20,93.9 42,93.9 23.6,58.3 25.5,55.6 28.5,55.6 28.5,58.3 62,52.2 58.7,52.2 55.2,52.1 57.5,49.6 52,51.2 63.5,44 63.5,41.3 66.7,44 69.8,44 72.5,44 75.5,44 66.7,41.3 69.8,41.3 72.5,41.3 75.4,41.3 66,52.2 74,56.2 74,53.6 76,53.6 82,58.8 76,56.2 80.2,75.2 84.8,74.8 81.4,82.3 79.6,84.1 75.2,64.8 80.2,77.9 80,80.1 77.3,82.7 82,84.1 86,84.1 60.4,41.3 55.4,43.6 52.48,48.48 56,47.9 41.3,26.6 43.2,28.6 45,30.4 46.9,32.3 48.8,34.2 50.9,36.3 53,38.4 49.76,46.76 47.64,44.74 45.52,42.52 43.2,40.32 39.7,41.84 38.02,43.54 40.4,47.3 42.5,49.5 44.1,51.8 40.1,39.08 37.7,39.78 35.3,43.58 36.1,46.68 38.1,48.88 40.22,51.1 44.3,53.7 22.46,55.58 19.5,56.4 18.4,64.8 20.8,66.3 23.6,66.9 19.9,60.4 20.04,62.38 21.3,63.6 78.6,43.8 81.1,42.5 82.3,40.7 80.1,38.3 79,33.2 78,41.2 75.5,35.2 62,47.6 31.5,58.3 31.5,55.6 34.5,58.3 34.5,55.6 36.8,55.6 37.4,54.9 37.5,58.3 39.8,58.3 48,61.7 42.6,60.1 50.22,64.02 52.6,66.4 50.9,68.5 55,68.8 53.2,70.8 15,79.9 25,79.9 45,79.9 54.5,80 40,74.9 20,74.9 15,69.9 10,64.9 17,60.3 45,69.9 40,64.9 53.7,93.9 71.3,73.8 93.7,93.8 90,64.9 84.8,62.5 82.8,38.2 90,34.9 85,29.9 90,24.9 85,19.9 90,14.9 85,9.9 80,14.9 75,9.9 70,14.9 75,19.9 80,24.9 65,9.9 60,14.9 55,19.9 40.5,22.6 40,14.9 35,9.9 30,14.9 25,19.9 28.5,25.8 33.4,20.7 55,29.9 60,34.9 25,9.9 20,14.9 15,9.9 10,14.9 10,24.9 10,34.9 15,29.9 15,19.9 20,24.9 25.9,28.4 15,39.9 20,44.9 30,44.9 65,89.9 82.8,76.8 79.3,74.3 87,51.7 83,51.7 51.8,16.7 51.8,12.7 5.7,79.3 8.8,79.4 11.3,79.3 82.6,80.7 85.2,80.5 85.3,78.5 86.6,77.9 86.6,74 82.8,72.5 78.5,36.1 79.7,39.9 59.3,47.5 55.5,45.9 54.8,40.4 38.54,45.42 44.3,55.9 44.4,58 46.1,59.9 44.1,61.6 46,63.6 48.3,65.9 57.4,71.2 55.9,73.4 59.6,73.4 58,75.6 61.5,75.3 60,77.6 63.9,75.8 66.8,75.8 69.9,72.6 72.7,69.8 71.1,69.2 69.2,71 73.4,75.7 71.3,75.8 74.5,74.5 75.8,73.3 73.9,71.2 89.4,73.8 89.4,78 71.3,25.8 73.9,28.4 75.9,28.4 75.8,26.3 73.4,23.9 74.6,25.2 70.1,26.7 69.3,28.4 71.1,30.4 72.8,29.7 23.8,28.3 24,26.3 25.2,25.2 26.4,23.9 28.6,23.9 29.7,26.8 30.5,29 28.9,30.4 27,29.7 25.3,74.5 29.8,72.7 27,69.9 76.5,32.5 80.7,34.2 82,35.7 65.3,24.4 37.3,24.2 38.5,21.7 39.3,25 42.06,23.74 43.7,25.4 45.6,27.3 47.4,29 49.2,30.9 51.1,32.7 52.9,34.6 54.9,36.6 56.7,38.3 57.7,39.9 36.1,41.18 41.8,42.62 43.9,44.82 46,46.92 48.6,49.32 17.2,62.6 24.3,64.32 17.7,58.5 26,58.3 24.5,34.9 23.9,33 22.5,31.8 36.5,77 77,63.2 78.8,63.8 3.4,3.6 96.4,3.6 96.4,8.1 91.5,3.6 84.8,3.6 3.5,8.1 9.3,3.6 14.6,3.6 6,93.9 12.5,93.9 64.3,93.9 67.5,92.9 68.8,89.9 68.8,87.4 73.3,84.1 76.5,84.1 74.9,89.9 74.9,86.9 80.9,89.9 80.9,86.9 87,89.9 87,87 93,87.3 74.7,79.7 64,78.7 70.6,82.4 69,81.3 79.9,65.2 77.3,69.8 75.8,66.5 77.3,67.8 71.3,23.8 65.2,17.7 23.1,36.4 22.5,29.8 80.2,72.5 80.6,68.5 82.8,75.2 82,55.2 78,53.6 66.6,78.7 70.5,84.1 73.2,82.4 72.6,80.5 71.2,79.1 69,78.7 54.78,49.28 21.2,58.7 35.8,20.9 35.2,24.3 32.5,23.2 67,81.3 65,81.3 63,81.3 61,81.3 59.1,81.3 59.1,78.7 61.6,78.7 54.6,82.1 56,83.3 57.4,81.9 57.4,78.1 56,76.7 54.6,77.9 84,70.9 84.8,68.5 84.8,66.5 84.8,64.5 84.8,60.5 84.8,58.9 82.2,60.5 82.2,62.5 82.2,64.5 82.2,68.5 82.2,66.9 84,57.1 80.8,70.5 78.7,81.4 68,52.2 68,49.6 70,50.1 70,53.7 72,52.1 71.3,55 64,52.2 78,56.2 80,56.9 80,53.7 62,62 75.9,71.2 68.6,19.1 69.8,20.3 67.4,17.9 69.9,22.4 68.1,22.6 67,23.5 64.4,20.6 63.2,22.4 20.4,29.9 19.2,31.1 18,32.3 17.8,34.4 19.9,34.4 20.7,35.3 24,73.3 23.9,71.2 25.9,71.2 28.8,69.2 30.5,71.2 28.5,73.8 28.5,75.8 26.4,75.7 31.2,80.5 29.9,79.4 29.9,77.2 31.9,77.2 34.5,79.8 34.5,81.8 32.4,81.7 35.9,78.6 33,75.8 34.8,75.2 61.1,44 66.5,46.8 62.6,44.7 38.9,55.6 55.4,41.8 18.1,90.3 18.4,85.2
  pour Top (isolate 0.2, rank 6): 0,0 0,94.6 99.8,94.6 99.8,0
  pour Bottom (isolate 0.2, rank 6): 0,0 0,94.6 99.8,94.6 99.8,0
  pour Route2 (isolate 0.2, rank 6): 0,0 0,94.6 99.8,94.6 99.8,0
  pour Route15 (isolate 0.2, rank 6): 0,0 0,94.6 99.8,94.6 99.8,0
L1BAND  (via drill 0.38)
  Top 0.38: CM1.RF v71.9,84
  Bottom 0.38: v71.9,84 71.9,82.54 arc-90 69.36,80 J12.P$1
L1BAND_0  (via drill 1 pad 1.75)
  Bottom 0.38: v65.3,22.4 J16.P$1
L1BAND_90  (via drill 1 pad 1.75)
  Bottom 0.38: v22.5,34.4 J15.P$1
L1BAND_180  (via drill 1 pad 1.75)
  Bottom 0.38: v34.5,77.2 J14.P$1
L1BAND_270  (via drill 1 pad 1.75)
  Bottom 0.38: J13.P$1 v77.3,65.2 | v77.3,65.2
LBAND  (via drill 0.38)
  Top 0.38: CM2.RF v77.9,84
  Bottom 0.38: v77.9,84 80.91,80.99 arc-45 81.5,79.57 81.5,72.43 arc45 82.09,71.01 82.91,70.19 arc-45 83.5,68.77 83.5,59.33 arc-45 82.91,57.91 80.49,55.49 arc-45 79.07,54.9 73.83,54.9 arc45 72.41,54.31 69.59,51.49 arc-45 68.17,50.9 U1.1
LBAND-1/4L
  Bottom 0.38: U1.6 57.23,50.89 arc45 48.11,47.11 42.54,41.54 arc-180 37.64,46.44 42.09,50.89 arc45 42.99,53.01 42.99,53.03 U3.1
LBAND-SHORT
  Bottom 0.38: U1.4 59.83,48.91 arc90 56.81,45.91 56.81,45.89 U2.1
LBAND_0  (via drill 1 pad 1.75)
  Bottom 0.38: v77.3,34.4 arc180 77.3,42.67 U2.4
LBAND_90  (via drill 1 pad 1.75)
  Bottom 0.38: v34.5,22.4 34.63,22.4 arc45 41.92,25.42 55.68,39.18 arc45 56.81,41.96 56.81,41.98 U2.6
LBAND_180  (via drill 1 pad 1.75)
  Bottom 0.38: v22.5,65.2 arc180 22.5,56.92 U3.4
LBAND_270  (via drill 1 pad 1.75)
  Bottom 0.38: v65.3,77.2 62.53,77.2 arc45 60.94,76.54 43.71,59.31 arc45 42.97,57.53 42.97,56.95 U3.6
MAG-POWER  (via drill 0.25)
  Top 0.5: CF1.5 10.13,78.05 v5.75,78.05 4.67,78.05 CF1.6
  Bottom 0.5: J6.6 J6.5 37.77,91.17 36.9,92.05 7.75,92.05 4.65,88.95 4.65,79.15 v5.75,78.05 v6.35,78.05
MAG-SCL  (via drill 0.25)
  Top 0.3: CF1.4 v5.7,76.8 CF1.3
  Bottom 0.3: J6.4 J6.3 39.05,91.23 37.7,92.57 7.53,92.57 4.13,89.17 4.13,77.77 5.1,76.8 v5.7,76.8
MAG-SDA  (via drill 0.25)
  Top 0.3: CF1.2 4.67,75.5 v5.7,75.5 10.12,75.5 CF1.1
  Bottom 0.3: J6.2 J6.1 40.31,91.19 38.5,93 7.35,93 3.6,89.25 3.6,76.8 4.9,75.5 v5.7,75.5
N$3
  Bottom 0.38: R1.2 U1.3
N$4
  Bottom 0.38: R2.2 58.81,44.7 U2.3
N$6
  Bottom 0.38: R3.2 40.98,54.9 U3.3
N$7
  Top 0.3: J1.7 J1.8 50.5,84.25 TP1.1
N$8
  Top 0.3: J2.7 J2.8 17.46,50.44 TP2.1
N$9
  Top 0.3: J3.7 J3.8 49.27,17.5 TP3.1
N$10
  Top 0.3: J4.7 J4.8 82.4,49.16 TP4.1
TURNSTILE-DEPLOY  (via drill 0.25)
  other vias: 35.3,84.7 34.6,85.1 34.6,84.4 35.9,84.4 35.9,85.1
  pour Route2 (isolate 0.2, no thermals): 33.8,90.5 33.8,54.5 51.6,54.5 51.6,68 42.5,77.1 42.5,90.5
  pour Bottom (isolate 0.2, no thermals): 36.2,84 36.2,90.1 34.3,90.1 34.3,84
  pour Top (isolate 0.2, no thermals): 36.2,84 36.2,90.1 34.3,90.1 34.3,84
UHF  (via drill 0.38)
  Top 0.38: CM3.RF v83.9,84
  Bottom 0.38: v83.9,84 83.9,77.9 arc90 85.9,75.9 J7.P$1
UHF_0  (via drill 1 pad 1.75)
  Bottom 0.38: J11.P$1 v71.3,71.2
UHF_90  (via drill 1 pad 1.75)
  Bottom 0.38: J10.P$1 v28.5,71.2
UHF_180  (via drill 1 pad 1.75)
  Bottom 0.38: J9.P$1 v28.5,28.4
UHF_270  (via drill 1 pad 1.75)
  Bottom 0.38: J8.P$1 v71.3,28.4
VBUS  (via drill 0.25)
  Top 0.5: J1.6 J1.5
  other vias: 49.2,86.4 49.2,86.9 49.2,87.4 13.3,49.2 12.8,49.2 12.3,49.2 86.6,50.4 87.1,50.4 87.6,50.4 50.5,13.2 50.5,12.7 50.5,12.2 25.1,84.3 26.4,84.3 26.4,85 25.8,84.7 25.1,85
  pour Route15 (isolate 0.2): 2,87.9 6,91.9 26.9,91.9 26.9,86.4 48.6,86.4 48.6,87.8 50,87.8 50,83.9 11,83.9 6,78.9 6,50.9 14,50.9 14,47.9 6,47.9 6,12.9 10,8.9 49,8.9 49,13.9 52,13.9 52,8.9 90,8.9 94,12.9 94,44.9 90,48.9 86,48.9 86,51.9 92,51.9 98,45.9 98,11.8 91.1,4.9 8.7,4.9 2,11.6
  pour Top (isolate 0.2, no thermals): 50,83.9 50,87.8 48.6,87.8 48.6,83.9
  pour Top (isolate 0.2, no thermals): 15.8,49.9 11.9,49.9 11.9,48.4 15.8,48.4
  pour Top (isolate 0.2, no thermals): 84.1,49.7 88,49.7 88,51.2 84.1,51.2
  pour Top (isolate 0.2, no thermals): 49.8,15.7 49.8,11.8 51.3,11.8 51.3,15.7
  pour Top (isolate 0.2, no thermals): 26.8,83.9 26.8,90 24.7,90 24.7,83.9
  pour Bottom (isolate 0.2, no thermals): 26.8,83.9 26.8,90 24.7,90 24.7,83.9

### Text on the board
tPlace: OreSat0 +Z End Card | v2.0 2021-11-01